# EAGLE design stm32f103_pin1 (EAGLE 6.1)
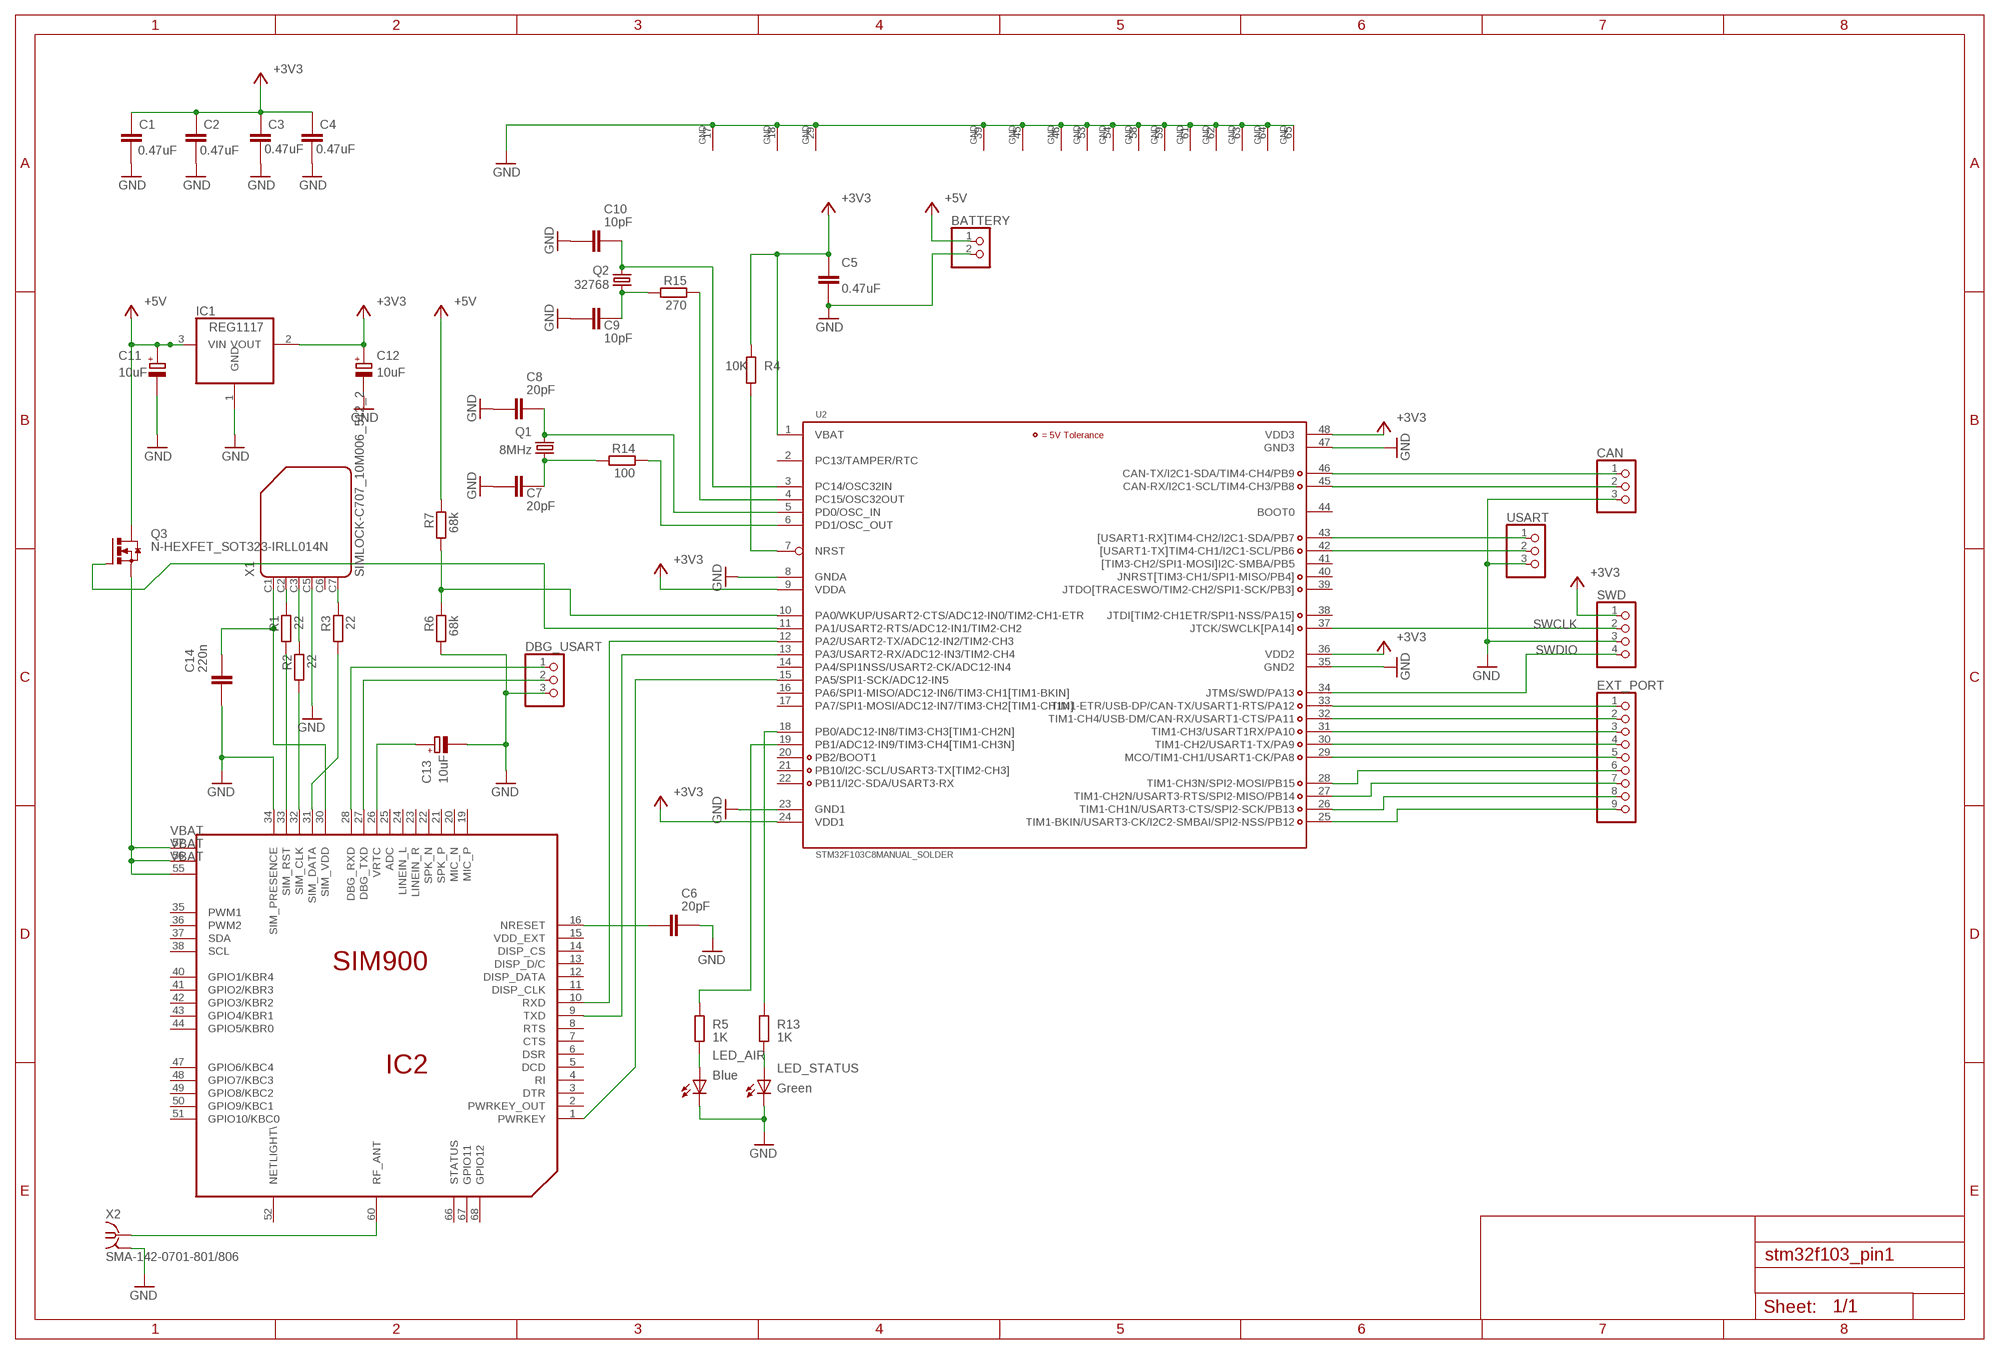
[diagram p0: schematic, sheet 1]

## Parts
BATTERY  PINHD-1X2  [1X02]
C1  0.47uF  CAPACITOR_0805  [CAPC2012X145AN]
C2  0.47uF  CAPACITOR_0805  [CAPC2012X145AN]
C3  0.47uF  CAPACITOR_0805  [CAPC2012X145AN]
C4  0.47uF  CAPACITOR_0805  [CAPC2012X145AN]
C5  0.47uF  CAPACITOR_0805  [CAPC2012X145AN]
C6  20pF  CAPACITOR_0805  [CAPC2012X145AN]
C7  20pF  CAPACITOR_0805  [CAPC2012X145AN]
C8  20pF  CAPACITOR_0805  [CAPC2012X145AN]
C9  10pF  CAPACITOR_0805  [CAPC2012X145AN]
C10  10pF  CAPACITOR_0805  [CAPC2012X145AN]
C11  10uF  POLARISED_A_CASE  [CAPMP3216X180N]
C12  10uF  POLARISED_A_CASE  [CAPMP3216X180N]
C13  10uF  POLARISED_A_CASE  [CAPMP3216X180N]
C14  220n  CAPACITOR_0805  [CAPC2012X145AN]
CAN  PINHD-1X3  [1X03]
DBG_USART  PINHD-1X3  [1X03]
EXT_PORT  PINHD-1X9  [1X09]
IC1  REG1117  [SOT223]
IC2  SIM900  [SIM900]
LED_AIR  Blue  LEDCHIP-LED0805  [CHIP-LED0805]
LED_STATUS  Green  LEDCHIP-LED0805  [CHIP-LED0805]
Q1  8MHz  CRYSTALHC49S  [HC49/S]
Q2  32768  CRYSTALTC38H  [TC38H]
Q3  N-HEXFET_SOT323-IRLL014N  [SOT223]
R1  22  RESISTOR_0805  [RESC2012X70N]
R2  22  RESISTOR_0805  [RESC2012X70N]
R3  22  RESISTOR_0805  [RESC2012X70N]
R4  10K  RESISTOR_0805  [RESC2012X70N]
R5  1K  RESISTOR_0805  [RESC2012X70N]
R6  68k  RESISTOR_0805  [RESC2012X70N]
R7  68k  RESISTOR_0805  [RESC2012X70N]
R13  1K  RESISTOR_0805  [RESC2012X70N]
R14  100  RESISTOR_0805  [RESC2012X70N]
R15  270  RESISTOR_0805  [RESC2012X70N]
SWD  PINHD-1X4  [1X04]
U2  STM32F103C8MANUAL_SOLDER  [LQFP48_IGORL]
USART  PINHD-1X3  [1X03]
X1  SIMLOCK-C707_10M006_512_2  [C707_10M006_512_2]
X2  SMA-142-0701-801/806  [J502-ND-142-0701-801/806]

## Nets
+3V3: C1.1 C2.1 C3.1 C4.1 C5.1 C12.+ IC1.2(VOUT) R4.2 SWD.1 U2.1(VBAT) U2.9(VDDA) U2.24(VDD1) U2.36(VDD2) U2.48(VDD3)
+5V: BATTERY.1 C11.+ IC1.3(VIN) Q3.4(D) R7.1
GND: BATTERY.2 C1.2 C2.2 C3.2 C4.2 C5.2 C6.1 C7.2 C8.2 C9.2 C10.2 C11.- C12.- C13.- C14.2 CAN.3 DBG_USART.3 IC1.1(GND) IC2.17(GND) IC2.18(GND) IC2.29(GND) IC2.34(SIM_PRESENCE) IC2.39(GND) IC2.45(GND) IC2.46(GND) IC2.53(GND) IC2.54(GND) IC2.58(GND) IC2.59(GND) IC2.61(GND) IC2.62(GND) IC2.63(GND) IC2.64(GND) IC2.65(GND) LED_AIR.C LED_STATUS.C R6.2 SWD.3 U2.8(GNDA) U2.23(GND1) U2.35(GND2) U2.47(GND3) USART.3 X1.C5 X2.G@1(GND)
N$1: IC2.10(RXD) U2.12(PA2/USART2-TX/ADC12-IN2/TIM2-CH3)
N$2: R15.1 U2.4(PC15/OSC32OUT)
N$3: C7.1 Q1.1 R14.2
N$4: C10.1 Q2.2 U2.3(PC14/OSC32IN)
N$5: IC2.9(TXD) U2.13(PA3/USART2-RX/ADC12-IN3/TIM2-CH4)
N$6: IC2.1(PWRKEY) U2.15(PA5/SPI1-SCK/ADC12-IN5)
N$7: C9.1 Q2.1 R15.2
N$8: IC2.60(RF_ANT) X2.1
N$9: C8.1 Q1.2 U2.5(PD0/OSC_IN)
N$10: R14.1 U2.6(PD1/OSC_OUT)
N$11: R4.1 U2.7(NRST)
N$12: C14.1 IC2.30(SIM_VDD) X1.C1
N$13: IC2.33(SIM_RST) R1.2
N$14: IC2.32(SIM_CLK) R2.2
N$15: IC2.31(SIM_DATA) R3.2
N$16: R3.1 X1.C7
N$17: C6.2 IC2.16(NRESET)
N$18: R1.1 X1.C2
N$19: R2.1 X1.C3
N$20: DBG_USART.2 IC2.27(DBG_TXD)
N$21: DBG_USART.1 IC2.28(DBG_RXD)
N$22: C13.+ IC2.26(VRTC)
N$23: CAN.2 U2.45(CAN-RX/I2C1-SCL/TIM4-CH3/PB8)
N$24: U2.42([USART1-TX]TIM4-CH1/I2C1-SCL/PB6) USART.2
N$25: U2.43([USART1-RX]TIM4-CH2/I2C1-SDA/PB7) USART.1
N$26: EXT_PORT.1 U2.33(TIM1-ETR/USB-DP/CAN-TX/USART1-RTS/PA12)
N$27: EXT_PORT.2 U2.32(TIM1-CH4/USB-DM/CAN-RX/USART1-CTS/PA11)
N$28: EXT_PORT.3 U2.31(TIM1-CH3/USART1RX/PA10)
N$29: EXT_PORT.4 U2.30(TIM1-CH2/USART1-TX/PA9)
N$30: EXT_PORT.5 U2.29(MCO/TIM1-CH1/USART1-CK/PA8)
N$31: EXT_PORT.6 U2.28(TIM1-CH3N/SPI2-MOSI/PB15)
N$32: EXT_PORT.7 U2.27(TIM1-CH2N/USART3-RTS/SPI2-MISO/PB14)
N$33: EXT_PORT.8 U2.26(TIM1-CH1N/USART3-CTS/SPI2-SCK/PB13)
N$34: EXT_PORT.9 U2.25(TIM1-BKIN/USART3-CK/I2C2-SMBAI/SPI2-NSS/PB12)
N$36: CAN.1 U2.46(CAN-TX/I2C1-SDA/TIM4-CH4/PB9)
N$38: R13.2 U2.18(PB0/ADC12-IN8/TIM3-CH3[TIM1-CH2N])
N$39: LED_STATUS.A R13.1
N$40: LED_AIR.A R5.1
N$41: R5.2 U2.19(PB1/ADC12-IN9/TIM3-CH4[TIM1-CH3N])
N$43: R6.1 R7.2 U2.10(PA0/WKUP/USART2-CTS/ADC12-IN0/TIM2-CH1-ETR)
N$71: Q3.1(G) U2.11(PA1/USART2-RTS/ADC12-IN1/TIM2-CH2)
N$72: IC2.55(VBAT) IC2.56(VBAT) IC2.57(VBAT) Q3.3(S)
PA13: SWD.4 U2.34(JTMS/SWD/PA13)
PA14: SWD.2 U2.37(JTCK/SWCLK[PA14])
Unconnected: IC2.2(PWRKEY_OUT) IC2.3(DTR) IC2.4(RI) IC2.5(DCD) IC2.6(DSR) IC2.7(CTS) IC2.8(RTS) IC2.11(DISP_CLK) IC2.12(DISP_DATA) IC2.13(DISP_D/C) IC2.14(DISP_CS) IC2.15(VDD_EXT) IC2.19(MIC_P) IC2.20(MIC_N) IC2.21(SPK_P) IC2.22(SPK_N) IC2.23(LINEIN_R) IC2.24(LINEIN_L) IC2.25(ADC) IC2.35(PWM1) IC2.36(PWM2) IC2.37(SDA) IC2.38(SCL) IC2.40(GPIO1/KBR4) IC2.41(GPIO2/KBR3) IC2.42(GPIO3/KBR2) IC2.43(GPIO4/KBR1) IC2.44(GPIO5/KBR0) IC2.47(GPIO6/KBC4) IC2.48(GPIO7/KBC3) IC2.49(GPIO8/KBC2) IC2.50(GPIO9/KBC1) IC2.51(GPIO10/KBC0) IC2.52(NETLIGHT\) IC2.66(STATUS) IC2.67(GPIO11) IC2.68(GPIO12) U2.2(PC13/TAMPER/RTC) U2.14(PA4/SPI1NSS/USART2-CK/ADC12-IN4) U2.16(PA6/SPI1-MISO/ADC12-IN6/TIM3-CH1[TIM1-BKIN]) U2.17(PA7/SPI1-MOSI/ADC12-IN7/TIM3-CH2[TIM1-CH1N]) U2.20(PB2/BOOT1) U2.21(PB10/I2C-SCL/USART3-TX[TIM2-CH3]) U2.22(PB11/I2C-SDA/USART3-RX) U2.38(JTDI[TIM2-CH1ETR/SPI1-NSS/PA15]) U2.39(JTDO[TRACESWO/TIM2-CH2/SPI1-SCK/PB3]) U2.40(JNRST[TIM3-CH1/SPI1-MISO/PB4]) U2.41([TIM3-CH2/SPI1-MOSI]I2C-SMBA/PB5) U2.44(BOOT0) X1.C6

## Notes on the sheet
- SWCLK
- SWDIO

## Power pins joined to a net without a drawn wire
GND: X2.G@2(GND) X2.G@3(GND) X2.G@4(GND)

## Library data of the parts
BATTERY = pinhead:PINHD-1X2: PIN HEADER
C1-C10 C14 = ipc-7351-capacitor:CAPACITOR_
C11-C13 = ipc-7351-capacitor:POLARISED_
CAN DBG_USART USART = pinhead:PINHD-1X3: PIN HEADER
EXT_PORT = pinhead:PINHD-1X9: PIN HEADER
IC1 = burr-brown:REG1117: 800mA and 1A Low Dropout (LDO) Positive Regulator 1.8V, 2.5V, 2.85V, 3.3V, 5V, and Adj; MPN: REG1117; OC_FARNELL: 1097566; OC_NEWARK: 14P6981
IC2 = sim900:SIM900
LED_AIR LED_STATUS = jlab:LED: LED OSRAM: - CHIPLED LG R971, LG N971, LY N971, LG Q971, LY Q971, LO R971, LY R971 LH N974, LH R974 LS Q976, LO Q976, LY Q976 LO Q996 - Hyper CHIPLED LW Q18S LB Q993, LB Q99A, LB R99A - SideLED LS A670, LO A670, LY A670, LG A670, LP A670 LB A673, LV A673, LT A673, LW A673 LH A674 LY A675 LS A676, LA A676, LO A676, LY A676, LW A676 LS A679, LY A679, LG A679 - Hyper Micro SIDELED® LS Y876, LA Y876, LO Y876, LY Y876 LT Y87S - SmartLED LW L88C, LW L88S LB L89C, LB L89S, LG L890 LS L89K, LO L89K, LY L89K LS L896, LA L896, LO L896, LY L896 - TOPLED LS T670, LO T670, LY T670, LG T670, LP T670 LSG T670, LSP T670, LSY T670, LOP T670, LYG T670 LG T671, LOG T671, LSG T671 LB T673, LV T673, LT T673, LW T673 LH T674 LS T676, LA T676, LO T676, LY T676, LB T676, LH T676, LSB T676, LW T676 LB T67C, LV T67C, LT T67C, LS T67K, LO T67K, LY T67K, LW E67C LS E67B, LA E67B, LO E67B, LY E67B, LB E67C, LV E67C, LT E67C LW T67C LS T679, LY T679, LG T679 LS T770, LO T770, LY T770, LG T770, LP T770 LB T773, LV T773, LT T773, LW T773 LH T774 LS E675, LA E675, LY E675, LS T675 LS T776, LA T776, LO T776, LY T776, LB T776 LHGB T686 LT T68C, LB T68C - Hyper Mini TOPLED® LB M676 - Mini TOPLED Santana® LG M470 LS M47K, LO M47K, LY M47K Source: http://www.osram.convergy.de LUXEON: - LUMILED® LXK2-PW12-R00, LXK2-PW12-S00, LXK2-PW14-U00, LXK2-PW14-V00 LXK2-PM12-R00, LXK2-PM12-S00, LXK2-PM14-U00 LXK2-PE12-Q00, LXK2-PE12-R00, LXK2-PE12-S00, LXK2-PE14-T00, LXK2-PE14-U00 LXK2-PB12-K00, LXK2-PB12-L00, LXK2-PB12-M00, LXK2-PB14-N00, LXK2-PB14-P00, LXK2-PB14-Q00 LXK2-PR12-L00, LXK2-PR12-M00, LXK2-PR14-Q00, LXK2-PR14-R00 LXK2-PD12-Q00, LXK2-PD12-R00, LXK2-PD12-S00 LXK2-PH12-R00, LXK2-PH12-S00 LXK2-PL12-P00, LXK2-PL12-Q00, LXK2-PL12-R00 Source: www.luxeon.com KINGBRIGHT: KA-3528ASYC Source: www.kingbright.com
Q1 = crystal:CRYSTAL: CRYSTAL; OC_FARNELL: 1667008; OC_NEWARK: unknown
Q2 = SparkFun-FreqCtrl:CRYSTAL: Various standard crystals. Proven footprints. Spark Fun Electronics SKU : COM-00534
Q3 = transistor-power:N-HEXFET_?-*: HEXFET® Power MOSFET
R1-R7 R13-R15 = ipc-7351-resistor:RESISTOR_
SWD = pinhead:PINHD-1X4: PIN HEADER
U2 = STM32_dhalt:STM32F103C8
X1 = con-amphenol:SIMLOCK-C707_10M006_512_2: C707A SIMLOCK® 2.5 mm with wide solder tails Source: Data sheet <http://www.amphenol.info/downloads/C707_10M006_512_2.pdf>; OC_FARNELL: unknown; OC_NEWARK: unknown
X2 = con-coax:SMA-: SMA 50 Ohm End Launch Jack Receptacle - Round Contact Johnson Components Source: www.johnsoncomponents.com .. J502-ND.pdf; MF: JOHNSON COMPONENTS; MPN: 142-0701-801; OC_FARNELL: 1608592; OC_NEWARK: 90F2624

## Board
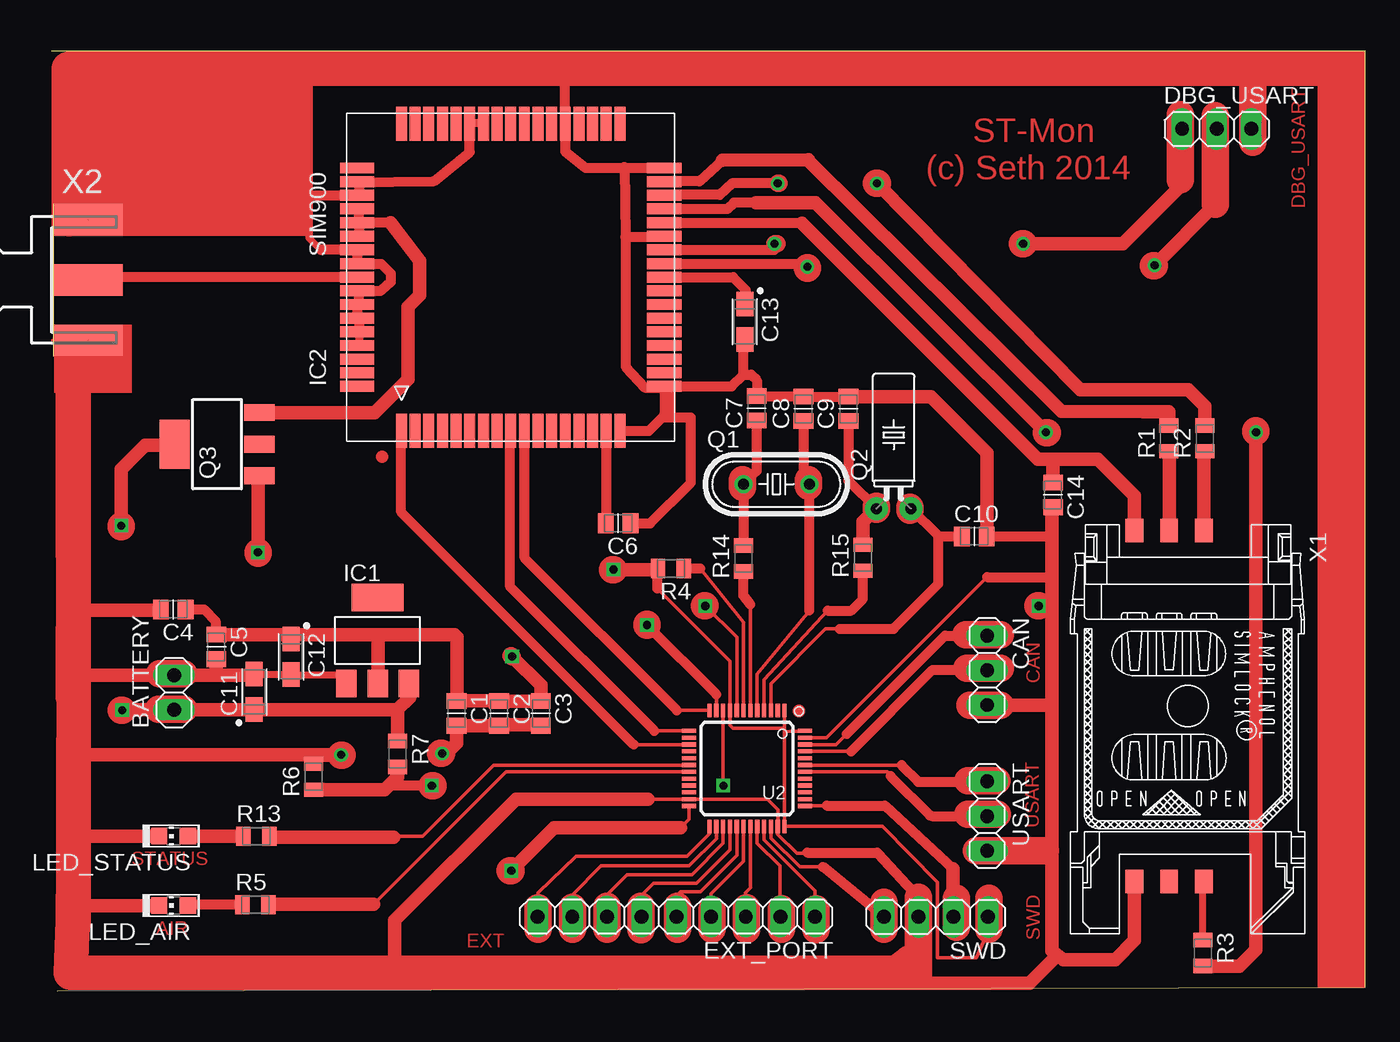
[diagram p1: board, top side]
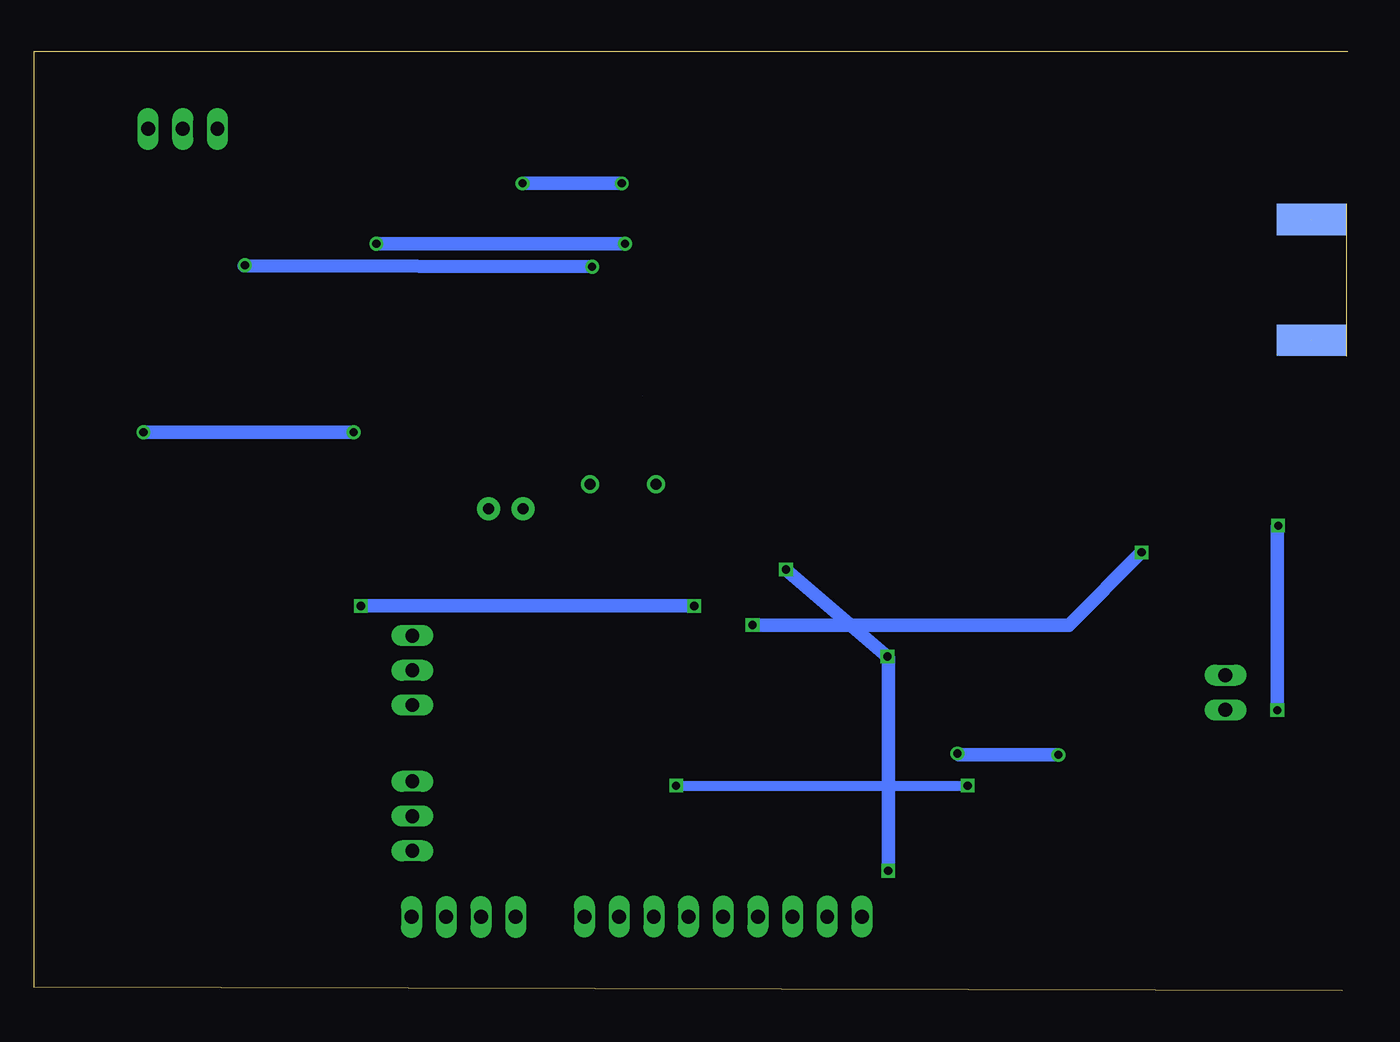
[diagram p2: board, bottom side, seen from below]

Size 96.23 x 68.8 mm. Coordinates in mm from the lower left corner, seen from the top.
Outline: 0.42,0 96.23,0.23 96.23,68.8 0,68.8
Copper layers (1*16): Top 0.035mm / dielectric 1mm / Bottom 0.035mm
Design rules: minimum track width 0.24mm, minimum drill 0.6mm, track to track 0.24mm, track to pad 1mm, pad to pad 1mm, via to via 1mm, smd to smd 1mm, copper to edge 40mil, drill to drill 2mm, minimum pad ring 10mil, minimum via ring 8mil, stop-mask expansion 4mil, vias tented up to drill 0mil, thermal gap 10mil

### Footprints (pad centres in the part's own frame; a part is rotated, then mirrored left to right if it is on the bottom)
1X02 = drill 1.016 long: 1 -1.27,0; 2 1.27,0
CAPC2012X145AN = smd 1.15 x 1.45: 1 -0.9,0; 2 0.9,0
CAPMP3216X180N = smd 1.8 x 1.25: + -1.3,0; - 1.3,0
1X03 = drill 1.016 long: 1 -2.54,0; 2 0,0; 3 2.54,0
1X09 = drill 1.016 long: 1 -10.16,0; 2 -7.62,0; 3 -5.08,0; 4 -2.54,0; 5 0,0; 6 2.54,0; 7 5.08,0; 8 7.62,0; 9 10.16,0
SOT223 = smd 1.499 x 2.007: 1 -2.261,-3.15; 2 0.025,-3.15; 3 2.311,-3.15 | smd 3.81 x 2.007: 4 0,3.15
SIM900 = smd 2.5 x 0.8: 1 -11.25,8; 2 -11.25,7; 3 -11.25,6; 4 -11.25,5; 5 -11.25,4; 6 -11.25,3; 7 -11.25,2; 8 -11.25,1; 9 -11.25,0; 10 -11.25,-1; 11 -11.25,-2; 12 -11.25,-3; 13 -11.25,-4; 14 -11.25,-5; 15 -11.25,-6; 16 -11.25,-7; 17 -11.25,-8; 35 11.25,-8; 36 11.25,-7; 37 11.25,-6; 38 11.25,-5; 39 11.25,-4; 40 11.25,-3; 41 11.25,-2; 42 11.25,-1; 43 11.25,0; 44 11.25,1; 45 11.25,2; 46 11.25,3; 47 11.25,4; 48 11.25,5; 49 11.25,6; 50 11.25,7; 51 11.25,8 | smd 0.8 x 2.5: 18 -8,-11.25; 19 -7,-11.25; 20 -6,-11.25; 21 -5,-11.25; 22 -4,-11.25; 23 -3,-11.25; 24 -2,-11.25; 25 -1,-11.25; 26 0,-11.25; 27 1,-11.25; 28 2,-11.25; 29 3,-11.25; 30 4,-11.25; 31 5,-11.25; 32 6,-11.25; 33 7,-11.25; 34 8,-11.25; 52 8,11.25; 53 7,11.25; 54 6,11.25; 55 5,11.25; 56 4,11.25; 57 3,11.25; 58 2,11.25; 59 1,11.25; 60 0,11.25; 61 -1,11.25; 62 -2,11.25; 63 -3,11.25; 64 -4,11.25; 65 -5,11.25; 66 -6,11.25; 67 -7,11.25; 68 -8,11.25
CHIP-LED0805 = smd 1.2 x 1.2: A 0,-1.05; C 0,1.05
HC49/S = drill 0.813: 1 -2.413,0; 2 2.413,0
TC38H = drill 0.813 pad 1.676: 1 -1.27,0; 2 1.27,0
SOT223' = smd 1.219 x 2.235: 1 -2.311,-3.099; 2 0,-3.099; 3 2.311,-3.099 | smd 3.6 x 2.2: 4 0,3.099
RESC2012X70N = smd 1.05 x 1.4: 1 -0.95,0; 2 0.95,0
1X04 = drill 1.016 long: 1 -3.81,0; 2 -1.27,0; 3 1.27,0; 4 3.81,0
LQFP48_IGORL = smd 0.3 x 1: 1 -2.75,-4.25; 2 -2.25,-4.25; 3 -1.75,-4.25; 4 -1.25,-4.25; 5 -0.75,-4.25; 6 -0.25,-4.25; 7 0.25,-4.25; 8 0.75,-4.25; 9 1.25,-4.25; 10 1.75,-4.25; 11 2.25,-4.25; 12 2.75,-4.25; 25 2.75,4.25; 26 2.25,4.25; 27 1.75,4.25; 28 1.25,4.25; 29 0.75,4.25; 30 0.25,4.25; 31 -0.25,4.25; 32 -0.75,4.25; 33 -1.25,4.25; 34 -1.75,4.25; 35 -2.25,4.25; 36 -2.75,4.25 | smd 1 x 0.3: 13 4.25,-2.75; 14 4.25,-2.25; 15 4.25,-1.75; 16 4.25,-1.25; 17 4.25,-0.75; 18 4.25,-0.25; 19 4.25,0.25; 20 4.25,0.75; 21 4.25,1.25; 22 4.25,1.75; 23 4.25,2.25; 24 4.25,2.75; 37 -4.25,2.75; 38 -4.25,2.25; 39 -4.25,1.75; 40 -4.25,1.25; 41 -4.25,0.75; 42 -4.25,0.25; 43 -4.25,-0.25; 44 -4.25,-0.75; 45 -4.25,-1.25; 46 -4.25,-1.75; 47 -4.25,-2.25; 48 -4.25,-2.75
C707_10M006_512_2 = smd 1.7 x 1.3: C1 -12.85,-3.915; C2 -12.85,-1.375; C3 -12.85,1.165; C5 12.85,-3.915; C6 12.85,-1.375; C7 12.85,1.165
J502-ND-142-0701-801/806 = smd 5.08 x 2.286: 1 2.565,0; G@1 2.565,4.42; G@2 2.565,-4.42 | smd 5.08 x 2.286 bottom: G@3 2.565,4.42; G@4 2.565,-4.42

### Placement (x,y rotation side)
BATTERY  8.96,21.83 90 top
C1  29.66,20.3 270 top
C2  32.77,20.3 270 top
C3  35.83,20.3 270 top
C4  8.91,27.91 180 top
C5  12.06,25.17 270 top
C6  41.49,34.21 180 top
C7  51.64,42.64 90 top
C8  55.07,42.6 90 top
C9  58.36,42.6 90 top
C10  67.58,33.26 0 top
C11  14.84,21.88 90 top
C12  17.54,24.44 270 top
C13  50.77,48.98 270 top
C14  73.35,36.3 270 top
CAN  68.52,23.45 270 top
DBG_USART  85.34,63.1 0 top
EXT_PORT  45.76,5.41 180 top
IC1  23.86,25.64 0 top
IC2  33.62,52.24 90 top
LED_AIR  8.92,6.23 90 top
LED_STATUS  8.92,11.31 90 top
Q1  53.08,37.08 0 top
Q2  61.68,35.29 0 top
Q3  N-HEXFET_SOT323-IRLL014N  [SOT223']  12.11,40.01 90 top
R1  81.84,40.44 90 top
R2  84.46,40.44 90 top
R3  84.32,2.76 270 top
R4  45.36,30.91 180 top
R5  14.93,6.3 0 top
R6  19.18,15.66 90 top
R7  25.34,17.33 270 top
R13  15,11.31 0 top
R14  50.67,31.64 90 top
R15  59.42,31.7 90 top
SWD  64.77,5.4 180 top
U2  50.93,16.27 180 top
USART  68.52,12.78 270 top
X1  83.23,20.84 270 top
X2  0.1,52.04 0 top

### Tracks (layer width: path | path; a pad name or v marks a point on that pad's centre or on a via)
+3V3  (via drill 0.6)
  Top 0.25: 53.72,18.96 53.68,18.58 U2.36 60.87,12.02 64.88,7.94 64.88,2.41 67.75,2.41 68.66,4.51 | 53.72,18.96 54.1,19 55.16,19 U2.48 | U2.1 53.68,19.21 | 53.68,19.21 53.68,18.65 53.72,18.96 | 53.68,19.21 49.9,19.21 49.68,19.43 U2.9 49.68,24.12 44.37,29.43 | 44.37,30.87 R4.2 | U2.24 46.68,12.56 46.05,11.93 | SWD.1 68.66,5.42
  Top 0.254: 12,26.16 12.1,26.06 | 17.6,26.16 17.5,26.06 17.5,25.76 | 23.9,22.5 IC1.2 | 29.5,26.06 29.7,25.86 | 29.7,21.24 C1.1 | 17.5,25.76 17.6,25.66 | 17.5,25.76 17.52,25.76 C12.+
  Top 0.5: C5.1 12.09,26.07 12.1,26.06
  Top 0.75: C4.1 11.15,27.91 12,27.06 12,26.16 | 44.37,29.43 44.37,30.87
  Top 1: 12.1,26.06 17.5,26.06 23.9,26.06 | 23.9,26.06 23.9,22.5 | 23.9,26.06 29.5,26.06 | 29.7,25.86 29.7,21.24 32.73,21.24 C2.1 C3.1 35.83,22.36 v33.73,24.46 | v41.15,30.83 44.33,30.83 R4.2 | 46.05,11.93 36.81,11.93 v33.66,8.78
  Top 1.27: v33.73,24.46 arc-90 33.66,24.53 | v33.66,8.78 arc90 33.52,8.64
  Top 2: 68.66,4.51 68.66,5.42 | v33.66,8.78 33.59,8.78 | v41.15,30.83 41.08,30.83
  Bottom 0.25: 33.66,24.39 v33.73,24.46
  Bottom 1: v33.73,24.46 v41.15,30.83 | v33.66,8.78 33.66,24.39
+5V  (via drill 0.6)
  Top 0.254: IC1.3 26.17,22.33 25.9,22.06 26.2,21.76 26.2,21.46 | 25.34,20.52 25.3,20.56 | C11.+ 8.98,20.58 BATTERY.1
  Top 1: BATTERY.1 25.3,20.56 26.2,21.46 | R7.1 25.34,20.52 | 8.98,20.58 5.21,20.58 v5.17,20.54 | v5.1,34.05 5.1,38.18 6.85,39.93 9.02,39.93 | 9.02,39.93 9.09,40 | 9.09,40 9.23,40.14 | Q3.4 9.08,40.01 9.09,40 | 9.09,40 Q3.4 | 9.02,39.93 9.09,39.93 9.16,39.86
  Top 2: v5.1,34.05 5.1,33.98 | v5.17,20.54 5.1,20.54
  Bottom 1: v5.17,20.54 5.17,33.98 v5.1,34.05
GND  (via drill 0.6)  (3 unrouted)
  Top 0.25: 60.54,10.04 54.59,10.04 53.18,11.45 U2.35 53.19,13.26 52.43,14.02 U2.23 43.66,14.02 | 63.48,5.42 SWD.3 | 25.12,0.87 25.05,0.8 61.52,0.8 63.13,2.41 | X2.G@4 0.07,47.62 | 34,14.02 34,13.81 25.19,5 25.19,0.87 25.05,0.73 1.95,0.73 1.53,1.15 1.53,3.6 1.53,4.5 | U2.8 50.18,25.86 v47.87,28.17 | 73.14,28.17 73.28,28.17 73.28,30.13 73.14,30.27 73.28,30.41 | U2.47 56.77,18.52 68.52,30.27 68.59,30.34 73.28,30.34 73.28,33.28 73.35,33.35 68.66,33.35 68.52,33.49 68.52,39.3 64.25,43.57 51.65,43.57 51.51,43.43 51.51,44.69 50.95,45.25 50.88,45.25 49.9,44.27 43.81,44.27 43.67,44.13 43.6,44.13 42.06,45.67 42.06,60.02 41.71,60.37 38.91,60.37 37.51,61.77 37.51,67.09 36.88,67.72 18.96,67.72 18.26,67.02 18.26,58.55 18.96,57.85 18.85,57.85
  Top 0.254: 3.15,47.9 1.65,47.9 1.55,47.31 | 3.15,47.9 3.25,47.9 3.25,48 3.15,47.9 | 21.65,23.14 IC1.1 | 8.01,27.86 C4.2 | 1.55,26.46 1.55,27.12 1.55,27.2 | 7.83,6.19 LED_AIR.C | 1.57,31.92 1.55,31.9 | 17.5,23.18 C12.- | 1.57,26.42 1.55,26.4 | C2.2 33.54,19.4 33.6,19.46 | 37.7,67.6 37.61,68 | 37.61,63.36 IC2.39 | IC2.34 42.11,60.24 41.95,60.3 | 44.88,55.2 IC2.29 42.09,55.24 42.05,55.2 | 44.81,44.16 IC2.18 44.85,44.22 | 22.5,47.25 IC2.65 | 22.5,48 IC2.64 22.5,48.25 | 22.5,49 IC2.63 | 22.25,50.25 IC2.62 22.5,50.25 | 22.5,51 IC2.61 | 31.5,63.5 IC2.45 | 24.09,51.24 24.15,51.3 24.18,51.3 | 30.75,63.5 IC2.46 30.62,63.42 | 22.25,53.2 IC2.59 | 22.06,59.2 IC2.53 22.5,59 | 22.5,58.25 IC2.54 22.25,58.2 | 3.15,56.7 3.25,56.7 0.35,56.8
  Top 0.406: X2.G@4 2.66,4.73 1.53,3.6 | C14.2 73.35,33.21 73.28,33.14 73.28,2.55 73.35,2.48 73.35,2.2 71.67,0.52 63.62,0.52 63.55,0.59 63.55,5.35 63.48,5.42 63.48,2.2 62.29,1.01 25.82,1.01 25.61,1.22 2.02,1.22 1.39,1.85 1.39,44.2 2.44,45.25 2.44,47.21 2.72,47.49 | DBG_USART.3 87.91,63.1 87.91,66.67 87,67.58 37.72,67.58 37.7,67.6
  Top 0.5: C12.- 21.65,23.14 | C11.- 17.5,23.18 | 28.7,17.36 v28.6,17.36 28.7,17.26 28.8,17.26 | 3.15,47.9 2.95,47.9 X2.G@4 | C14.2 73.35,34.1 | 19.71,54.24 18.85,55.1 18.85,57.85 18.85,58.2 3.25,58.2 | X2.G@1 2.91,56.7 3.15,56.7
  Top 0.6: 44.85,42.1 44.85,44.22 | 22.5,48 22.5,47.25 | 31.5,63.5 30.75,63.5
  Top 0.75: 1.79,27.91 1.74,27.96 | 63.48,6.82 60.54,10.04 60.47,10.11 55.36,10.11 | 37.61,68 37.61,63.36 37.61,61.46 39.11,60.24 IC2.34 | 73.28,33.35 73.19,33.26 C10.2 | 41.95,60.3 42.02,55.2 44.88,55.2 | C9.2 C8.2 55.03,43.53 C7.2 51.65,44.69 51.23,45.11 50.67,45.11 | C13.- 50.67,47.58 50.67,45.11 | 42.05,55.2 42.05,45.7 43.45,44.16 44.81,44.16 | 50.67,45.11 49.8,44.24 IC2.18 | IC2.17 43.74,40.99 44.85,42.1 44.99,41.96 46.82,41.96 46.82,37.2 43.83,34.21 C6.1 | 68.52,30.27 73.14,30.27 | 22.5,49 22.5,48.25 | IC2.62 IC2.63 | 22.5,50.25 22.5,51 | IC2.61 24.09,51.24 | 24.18,51.3 24.85,51.9 24.85,52.5 24.15,53.2 22.25,53.2 | 30.62,63.42 30.62,61.4 28,59.27 22.06,59.2 | IC2.59 IC2.58 19.71,54.24 | 22.5,59 22.5,58.25 | 22.25,58.2 18.85,58.2
  Top 1: 28.8,17.26 29.66,18.12 C1.2 C2.2 | 1.55,27.12 1.6,27.26 1.79,27.45 1.79,27.91 1.84,27.86 8.01,27.86 | 1.58,18.23 1.6,18.37 1.81,17.88 1.81,17.74 1.67,17.6 | 1.67,17.6 2.01,17.26 v21.2,17.26 v21.2,17.25 19.17,17.25 19.18,17.24 R6.2 | 1.67,17.6 1.81,17.6 1.88,17.53 | 1.6,22.85 1.85,23.1 BATTERY.2 12.03,23.1 | 12.03,23.1 14.76,23.1 C11.- | C5.2 12.06,23.13 12.03,23.1 | LED_STATUS.C 1.68,11.31 1.58,11.21 1.58,9.65 | LED_AIR.C 1.64,6.23 1.53,4.5 | 63.5,2.85 62.85,2.2 | 33.6,19.46 35.77,19.46 C3.2 | 25.12,0.87 25.12,5.14 34,14.02 43.66,14.02 43.67,14.03 | X1.C5 79.31,3.68 77.9,2.27 74.12,2.27 73.28,2.9 73.28,10.18 | CAN.3 73.12,20.91 73.28,20.75 | 72.8,10.24 73.28,10.18 | 73.28,20.75 73.28,10.18 | C14.2 73.28,35.4 73.28,33.35 73.28,33.14 73.28,20.75 | C10.2 68.52,33.3 68.52,39.37 64.39,43.5 C9.2 | 72.37,28.17 73.14,28.17 | 3.25,58.2 3.15,56.7
  Top 1.27: 21.27,17.25 21.34,17.25 | 72.37,28.17 v72.3,28.17 | v47.87,28.17 arc-90 47.8,28.24
  Top 2: SWD.3 63.5,2.85 | 63.48,6.82 63.48,5.42 | v21.2,17.25 21.27,17.25 | USART.3 72.8,10.24 | v47.87,28.17 47.8,28.17 | v72.3,28.17 72.23,28.17
  Top 2.54: 1.55,21.53 1.55,26.4 1.55,26.46 | 1.55,31.9 1.55,47.31 | 1.58,18.34 1.58,18.23 1.58,9.65 1.53,4.5 | 1.57,31.92 1.57,26.42 | 1.6,27.26 1.6,22.85 1.6,18.37
  Bottom 0.25: 72.23,28.17 v72.3,28.17
  Bottom 0.5: 28.5,17.26 v28.6,17.36
  Bottom 1: v21.2,17.26 28.5,17.26 | v47.87,28.17 72.23,28.17
N$1
  Top 0.25: 34.64,40.97 IC2.10 | 45.79,20.52 U2.12
  Top 0.75: 45.79,20.52 34.64,31.67 34.64,40.97
N$2
  Top 0.25: U2.4 52.18,22.75 56.83,27.82
  Top 0.75: 56.83,27.82 58.58,27.82 59.42,28.66 R15.1
N$3
  Top 0.254: Q1.1
  Top 0.75: C7.1 51.64,38.05 Q1.1 R14.2
N$4
  Top 0.25: U2.3 52.68,22.48 56.69,26.49 57.74,26.49 61.66,26.49 | 64.95,33.28 65.02,33.35 64.95,33.35 64.95,33.28 | 64.95,33.21 64.95,33.28
  Top 0.75: C10.1 66.66,33.28 64.95,33.28 64.95,33.29 Q2.2 | 61.66,26.49 64.95,29.78 64.95,33.21 | 57.74,26.49 61.59,26.49 61.66,26.56
N$5
  Top 0.25: U2.13 44.14,19.02 | 33.59,40.96 IC2.9
  Top 0.75: 44.14,19.02 33.59,29.57 33.59,40.96
N$6
  Top 0.25: U2.15 42.62,18.02 | IC2.1
  Top 0.75: 42.62,18.02 25.61,35.03 IC2.1
N$7
  Top 0.25: Q2.1 60.44,35.27
  Top 0.75: C9.1 58.36,37.35 60.44,35.27 60.47,35.24
  Top 1: R15.2 59.42,34.33 60.38,35.29 Q2.1
N$8
  Top 0.254: 2.91,52.24 2.85,52.3 2.55,52
  Top 0.5: 2.55,52 2.62,52 X2.1
  Top 0.75: IC2.60 2.91,52.24
N$9
  Top 0.25: U2.5 51.68,23.16 55.5,27.82 | Q1.2
  Top 0.75: C8.1 55.07,37.5 Q1.2 | 55.5,27.82 Q1.2
N$10
  Top 0.25: U2.6 51.18,28.29
  Top 0.75: 51.18,28.29 50.67,28.94 R14.1
N$11
  Top 0.25: U2.7 50.68,26.97 47.52,30.9 | R4.1
  Top 0.75: 47.52,30.9 R4.1
N$12
  Top 0.254: 44.75,56.2 44.85,56.2 44.87,56.22 IC2.30
  Top 0.5: C14.1 73.45,37.2 73.45,37.4 | 73.45,37.5 73.45,37.4 | 73.45,37.4 73.35,37.4
  Top 0.75: 54.95,56.2 44.85,56.2
  Top 1: X1.C1 79.31,36.23 76.65,38.9 73.35,38.9 | 73.35,38.9 72.25,38.9 54.95,56.2 | 73.35,37.4 73.35,38.9
N$13
  Top 0.254: 45,59 IC2.33 45.14,59.27
  Top 0.75: 55.42,60.77 55.43,60.83 | 49.13,60.79 47.45,59.25 45.14,59.27
  Top 1: R1.2 81.83,42.38 79.93,42.38 73.96,42.44 55.42,60.77 | 55.43,60.83 49.13,60.79
N$14  (via drill 0.6)
  Top 0.254: 44.91,58.27 IC2.32
  Top 0.75: v53.18,59.11 49.83,59.11 48.92,58.27 44.91,58.27
  Top 1: R2.2 84.46,42.79 83.25,44 75.35,44 v60.45,59.11
  Bottom 1: v60.45,59.11 v53.18,59.11
N$15  (via drill 0.6)
  Top 0.254: 45.19,57.2 IC2.31
  Top 0.75: 51.58,57.71 49.97,57.71 49.48,57.22 45.21,57.22 45.19,57.2
  Top 1: v72.83,40.89 55.96,57.69 51.58,57.71 | v88.22,40.89 88.22,3 87,1.78 84.35,1.78 R3.2
  Bottom 1: v72.83,40.89 v88.22,40.89
N$16
  Top 0.254: 84.32,7.91 X1.C7
  Top 0.5: R3.1 84.32,7.91
N$17
  Top 0.254: 40.62,34.23 C6.2
  Top 0.75: IC2.16 40.62,34.23
N$18
  Top 0.254: 81.86,39.47 R1.1
  Top 1: X1.C2 81.86,39.47
N$19
  Top 0.254: 84.39,39.42 R2.1
  Top 1: X1.C3 84.39,39.42
N$20  (via drill 0.6)
  Top 0.75: IC2.27 55.11,53.24 v55.35,53
  Top 1: DBG_USART.2 85.25,63.08 | 85.25,57.57 v80.79,53.11
  Top 2: 85.25,63.08 85.25,57.57
  Bottom 0.25: 80.83,53.07 v80.79,53.11
  Bottom 1: v55.35,53 80.83,53.07
N$21  (via drill 0.6)
  Top 0.406: DBG_USART.1 82.73,63.1 82.73,58.97
  Top 0.75: IC2.28 52.91,54.24 v52.95,54.69
  Top 1: v71.16,54.69 78.45,54.69 82.73,58.97
  Bottom 1: v52.95,54.69 v71.16,54.69
N$22
  Top 0.254: 50.85,51.3 50.85,50.36 C13.+
  Top 0.75: IC2.26 49.91,52.24 50.85,51.3
N$23
  Top 0.25: U2.45 58.57,17.52 | 68.49,23.48 CAN.2
  Top 0.75: 58.57,17.52 64.53,23.48 68.49,23.48
N$24
  Top 0.25: U2.42 61.21,16.02 64.46,12.77 | USART.2
  Top 0.75: 64.46,12.77 USART.2
N$25
  Top 0.25: U2.43 62.25,16.52 | 68.49,15.29 USART.1
  Top 0.75: 62.25,16.52 63.48,15.29 68.49,15.29
N$26
  Top 0.25: U2.33 52.18,11.05 55.92,7.31 EXT_PORT.1
N$27
  Top 0.25: U2.32 51.68,10.78 53.33,9.13 53.33,5.46 EXT_PORT.2
N$28
  Top 0.25: U2.31 51.18,7.54 50.81,7.17 50.81,5.44 EXT_PORT.3
N$29
  Top 0.25: U2.30 50.68,9.49 48.29,7.1 EXT_PORT.4
N$30
  Top 0.25: U2.29 50.18,9.9 47.52,7.24 46.05,7.24 45.77,6.96 45.77,5.43 EXT_PORT.5
N$31
  Top 0.25: U2.28 49.68,10.31 47.24,7.87 44.09,7.87 43.18,6.96 43.18,6.19 43.18,5.45 EXT_PORT.6
  Top 2: 43.18,6.19 43.18,4.44
N$32
  Top 0.25: U2.27 49.18,10.79 46.89,8.5 42.13,8.5 40.66,7.03 40.66,6.19 40.66,5.43 EXT_PORT.7
  Top 2: 40.66,6.19 40.66,4.51
N$33
  Top 0.25: U2.26 48.68,11.13 46.68,9.13 40.24,9.13 38.14,7.03 38.14,6.12 EXT_PORT.8
  Top 2: 38.14,6.12 38.14,4.51
N$34
  Top 0.25: U2.25 48.18,11.47 46.54,9.83 38.42,9.83 35.62,7.17 35.62,6.05 35.62,5.44 EXT_PORT.9
  Top 2: 35.62,6.05 35.62,4.51
N$36
  Top 0.25: CAN.1 | 58.23,18.79 57.46,18.02 U2.46
  Top 0.75: CAN.1 65.44,26 58.23,18.79
N$38
  Top 0.25: U2.18 32.37,16.52 27.15,11.3 R13.2
N$39
  Top 1: R13.1 LED_STATUS.A
N$40
  Top 0.75: R5.1 10.04,6.3 LED_AIR.A
N$41
  Top 0.25: U2.19 33.27,16.02 23.58,6.33 | 15.91,6.33 R5.2
  Top 1: 23.58,6.33 15.91,6.33
N$43  (via drill 0.6)
  Top 0.25: U2.10 49.18,15.03 v49.2,15.01 | 25.12,15.01 25.12,15.43
  Top 0.75: v27.85,15.01 25.12,15.01
  Top 1: R6.1 24.4,14.71 25.12,15.43 25.33,15.64 R7.2
  Top 2: v27.85,15.01 27.92,15.01
  Bottom 0.75: v49.2,15.01 v27.85,15.01
N$44
  Top 2.54: 91.4,67.5 1.25,67.5 1.25,56.5
N$64
  Top 1.016: 5.35,48.2 5.35,47.2
N$71  (via drill 0.6)
  Top 0.25: U2.11 48.68,21.69 | 15.11,37.6 Q3.1
  Top 0.75: 48.68,21.69 v43.6,26.77
  Top 1: v15.11,32.09 15.11,37.6
  Top 2: v15.11,32.09 15.11,32.02 | v43.6,26.77 43.6,26.84
  Bottom 1: v43.6,26.77 20.43,26.77 v15.11,32.09
N$72
  Top 0.254: 22.5,55.25 IC2.57 | 22.5,56 IC2.56 22.5,56.25 | 22.5,57 IC2.55
  Top 0.75: 22.5,56 22.5,55.25 | 22.5,56.25 22.5,57 | 24.84,56.24 22.46,56.24 | 22.46,56.24 22.39,56.31 | IC2.56 22.46,56.24
  Top 1: Q3.3 23.66,42.32 26.1,44.76 26.1,50.08 26.94,50.92 26.94,53.44 24.84,56.24
PA13
  Top 0.25: 56.48,9.06 54.8,9.06 52.7,11.16 52.7,12 U2.34
  Top 0.75: 60.98,5.4 56.48,9.06
  Top 2: SWD.4 60.98,5.4
PA14
  Top 0.25: U2.37 61.05,13.52 | 66,5.44 SWD.2
  Top 0.75: 61.05,13.52 66,8.92
  Top 1: 66,8.92 66,5.44
S$1
  Top 0.5: 66.39,44.58 66.53,44.72
S$3
  pour Top (no thermals): 1.45,67.6 1.65,67.8 19.45,67.8
S$4
  Top 2: 87.98,63.03 87.98,67.23
S$5
  Top 0.75: 45.14,42.24 45.35,42.45 45.35,43.71
S$6
  Top 1: 1.53,5.07 1.39,5.07
  Top 2.54: 62.92,2.06 61.87,1.29 1.39,1.29 1.53,5.07
S$7
  Top 1: 63.55,5.35 63.55,2.69 62.99,2.13
S$8
  Top 1: 16.3,11.23 25.05,11.23
S$9
  Top 0.75: 56.76,13.54 61.03,13.54
S$10
  Top 0.75: 61.45,15.71 64.32,12.84
S$11
  Top 2: 67.12,15.36 69.22,15.36
S$14
  Top 2: 67.12,12.91 69.29,12.91
S$16
  Top 2: 68.66,10.25 67.75,10.25
S$17
  Top 2: 67.26,20.89 69.5,20.89
S$18
  Top 2: 67.05,23.62 69.5,23.62
S$19
  Top 2: 66.98,26.07 69.5,26.07
S$20
  Top 2: 68.66,5.21 68.66,6.75
S$21
  Top 2: 60.96,6.47 60.96,4.51
S$22
  Top 2: 66.28,4.65 66.28,6.75
S$23
  Top 2: 45.84,6.19 45.84,4.51
S$24
  Top 2: 48.36,5.91 48.36,4.51
S$25
  Top 2: 50.88,6.05 50.88,4.44
S$26
  Top 2: 53.47,5.98 53.47,4.51
S$27
  Top 2: 55.99,5.98 55.99,4.44
S$28
  Top 2: 87.98,62.12 87.98,63.94
S$29
  Top 2: 85.25,64.08 85.25,62.33
S$30
  Top 2: 82.66,64.15 82.66,62.4
S$32
  Top 2: 82.66,63.73 82.66,59.39
S$33
  Top 1: 61.66,0.52 71.6,0.52 73.56,2.48
S$34
  Top 2: 9.65,23.2 8.6,23.2 8.25,23.2 7.9,23.2
S$35
  Top 2: 9.65,20.61 8.74,20.61 8.46,20.61 7.83,20.61
S$36
  Top 2: 50.6,37.41 50.6,36.85
S$37
  Top 2: 55.43,37.41 55.43,36.92
S$38
  Top 2: 60.4,35.45 60.4,35.24
S$39
  Top 2: 62.85,35.38 62.85,35.17
S$40
  Top 1.27: 71.18,54.63 71.18,54.7 71.18,54.77
  Top 2: 71.18,54.7 71.11,54.7
S$41
  Top 1.27: 80.77,53.09 80.77,53.02
  Top 2: 80.77,53.09 80.7,53.09
S$42
  Top 1.27: 53.19,59.11 53.26,59.11
S$43
  Top 1.27: 60.4,59.11 arc-90 60.33,59.18
  Top 2: 60.47,59.11 60.4,59.11
S$44
  Top 1.27: 52.98,54.7 53.12,54.7
S$45
  Top 1.27: 55.36,53.02 55.43,53.02
S$46
  Top 1.27: 72.93,40.84 73.07,40.84 arc90 73.14,40.91
  Top 2: 72.86,40.84 72.93,40.84
S$47
  Top 1.27: 88.26,40.91 88.19,40.91 88.05,40.91
  Top 2: 88.19,40.91 88.19,40.98
S$48
  Top 1.27: 28.69,17.32 28.55,17.32
S$49
  Top 2: 28.55,17.39 28.48,17.39
S$50
  Top 2: 55.36,52.95 55.36,52.88
(copper drawn outside any net)
  shapes: Top area x5, Top circle x2

### Text on the board
Top: ST-Mon | (c) Seth 2014 | DBG_USART | CAN | USART | STATUS | SWD | AIR | EXT